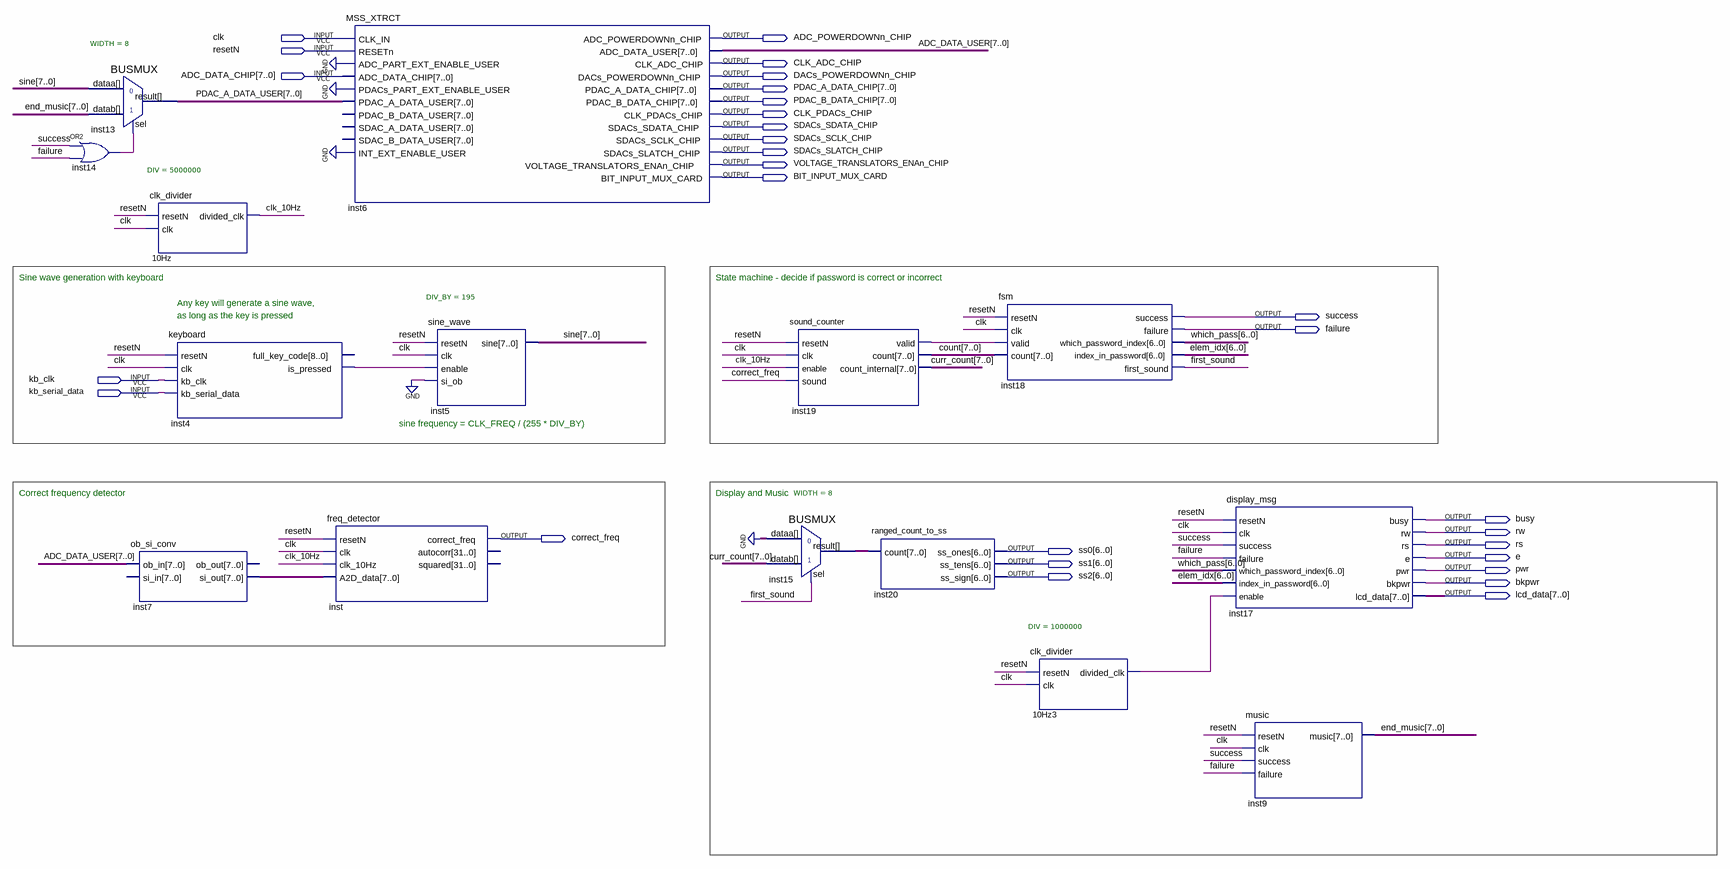
[diagram p0: schematic sheet]
// Quartus schematic top.bdf as structural Verilog: 15 symbols, 29 pins
module top (
  input  clk,
  input  resetN,
  input  [7:0] ADC_DATA_CHIP,
  input  kb_clk,
  input  kb_serial_data,
  output ADC_POWERDOWNn_CHIP,
  output CLK_ADC_CHIP,
  output DACs_POWERDOWNn_CHIP,
  output [7:0] PDAC_A_DATA_CHIP,
  output [7:0] PDAC_B_DATA_CHIP,
  output CLK_PDACs_CHIP,
  output SDACs_SDATA_CHIP,
  output SDACs_SCLK_CHIP,
  output SDACs_SLATCH_CHIP,
  output VOLTAGE_TRANSLATORS_ENAn_CHIP,
  output BIT_INPUT_MUX_CARD,
  output success,
  output failure,
  output busy,
  output rw,
  output correct_freq,
  output rs,
  output [6:0] ss0,
  output e,
  output [6:0] ss1,
  output pwr,
  output [6:0] ss2,
  output bkpwr,
  output [7:0] lcd_data
);

  wire clk_10Hz, first_sound, inst4_is_pressed, inst14_out, inst19_valid, n10Hz3_divided_clk;
  wire [6:0] elem_idx, which_pass;
  wire [7:0] ADC_DATA_USER, count, curr_count, end_music, inst7_si_out, inst15_result, PDAC_A_DATA_USER, sine;

  BUSMUX #(.WIDTH(8)) inst13 (.datab(end_music), .sel(inst14_out), .dataa(sine), .result(PDAC_A_DATA_USER));
  or inst14 (inst14_out, success, failure);
  clk_divider #(.DIV(5000000)) u_10Hz (.resetN(resetN), .clk(clk), .divided_clk(clk_10Hz));
  ob_si_conv inst7 (.ob_in(ADC_DATA_USER), .si_out(inst7_si_out));  // open: si_in, ob_out
  keyboard inst4 (
    .resetN(resetN), .clk(clk), .kb_clk(kb_clk), .kb_serial_data(kb_serial_data),
    .is_pressed(inst4_is_pressed));  // open: full_key_code
  MSS_XTRCT inst6 (
    .CLK_IN(clk), .RESETn(resetN), .ADC_PART_EXT_ENABLE_USER(1'b0), .ADC_DATA_CHIP(ADC_DATA_CHIP),
    .PDACs_PART_EXT_ENABLE_USER(1'b0), .PDAC_A_DATA_USER(PDAC_A_DATA_USER), .INT_EXT_ENABLE_USER(1'b0),
    .ADC_POWERDOWNn_CHIP(ADC_POWERDOWNn_CHIP), .ADC_DATA_USER(ADC_DATA_USER), .CLK_ADC_CHIP(CLK_ADC_CHIP),
    .DACs_POWERDOWNn_CHIP(DACs_POWERDOWNn_CHIP), .PDAC_A_DATA_CHIP(PDAC_A_DATA_CHIP),
    .PDAC_B_DATA_CHIP(PDAC_B_DATA_CHIP), .CLK_PDACs_CHIP(CLK_PDACs_CHIP),
    .SDACs_SDATA_CHIP(SDACs_SDATA_CHIP), .SDACs_SCLK_CHIP(SDACs_SCLK_CHIP),
    .SDACs_SLATCH_CHIP(SDACs_SLATCH_CHIP), .VOLTAGE_TRANSLATORS_ENAn_CHIP(VOLTAGE_TRANSLATORS_ENAn_CHIP),
    .BIT_INPUT_MUX_CARD(BIT_INPUT_MUX_CARD));  // open: PDAC_B_DATA_USER, SDAC_A_DATA_USER, SDAC_B_DATA_USER
  freq_detector inst (
    .resetN(resetN), .clk(clk), .clk_10Hz(clk_10Hz), .A2D_data(inst7_si_out), .correct_freq(correct_freq));  // open: autocorr, squared
  sine_wave #(.DIV_BY(195)) inst5 (.resetN(resetN), .clk(clk), .enable(inst4_is_pressed), .si_ob(1'b0), .sine(sine));
  sound_counter inst19 (
    .resetN(resetN), .clk(clk), .enable(clk_10Hz), .sound(correct_freq), .valid(inst19_valid), .count(count),
    .count_internal(curr_count));
  BUSMUX #(.WIDTH(8)) inst15 (.datab(curr_count), .sel(first_sound), .dataa({8{1'b0}}), .result(inst15_result));
  ranged_count_to_ss inst20 (.count(inst15_result), .ss_ones(ss0), .ss_tens(ss1), .ss_sign(ss2));
  fsm inst18 (
    .resetN(resetN), .clk(clk), .valid(inst19_valid), .count(count), .success(success), .failure(failure),
    .which_password_index(which_pass), .index_in_password(elem_idx), .first_sound(first_sound));
  clk_divider #(.DIV(1000000)) u_10Hz3 (.resetN(resetN), .clk(clk), .divided_clk(n10Hz3_divided_clk));
  display_msg inst17 (
    .resetN(resetN), .clk(clk), .success(success), .failure(failure), .which_password_index(which_pass),
    .index_in_password(elem_idx), .enable(n10Hz3_divided_clk), .busy(busy), .rw(rw), .rs(rs), .e(e),
    .pwr(pwr), .bkpwr(bkpwr), .lcd_data(lcd_data));
  music inst9 (.resetN(resetN), .clk(clk), .success(success), .failure(failure), .music(end_music));

  // Notes on the sheet:
  //   Sine wave generation with keyboard
  //   State machine - decide if password is correct or incorrect
  //   Any key will generate a sine wave,
  //   as long as the key is pressed
  //   sine frequency = CLK_FREQ / (255 * DIV_BY)
  //   Correct frequency detector
  //   Display and Music
endmodule
